# Altium schematic sheet ADC GPIO Expander.SchDoc
size A4; SheetNumber: 8; SheetTotal: 9
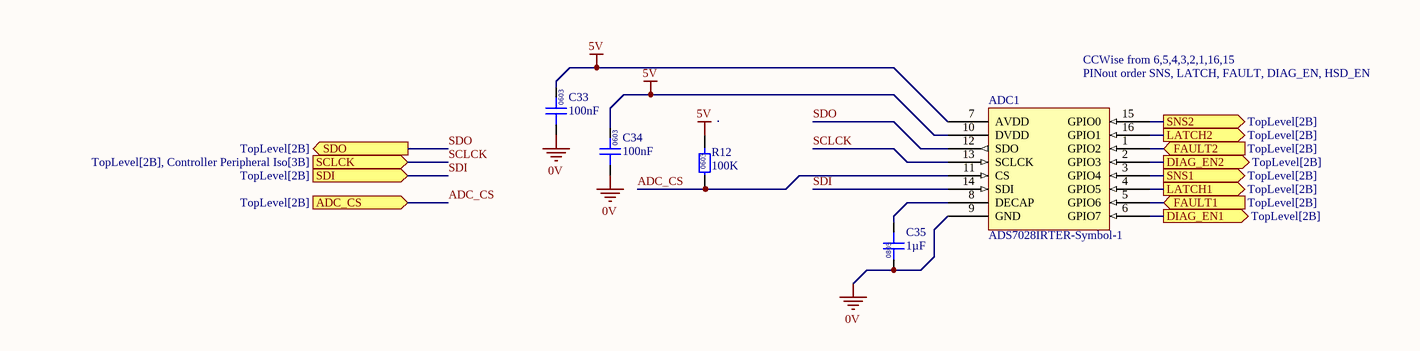
[diagram p0: ADC GPIO Expander.SchDoc]

## Parts
ADC1  ADS7028IRTER-Symbol-1  [WFQN-16]
C33  100nF  [0603]
C34  100nF  [0603]
C35  1µF  [0805]
R12  100K  [0603]

## Ports
ADC_CS (in, see TopLevel[2B]), DIAG_EN1 (out, see TopLevel[2B]), DIAG_EN2 (out, see TopLevel[2B]), FAULT1 (in, see TopLevel[2B]), FAULT2 (in, see TopLevel[2B]), LATCH1 (out, see TopLevel[2B]), LATCH2 (out, see TopLevel[2B]), SCLCK (in, see TopLevel[2B], Controller Peripheral Iso[3B]), SDI (in, see TopLevel[2B]), SDO (out, see TopLevel[2B]), SNS1 (out, see TopLevel[2B]), SNS2 (out, see TopLevel[2B])

## Nets
0V: ADC1.9(GND) C33.1 C34.1 C35.1
5V: ADC1.7(AVDD) ADC1.10(DVDD) C33.2 C34.2 R12.2
ADC_CS: ADC1.11(CS) R12.1 ; port ADC_CS
DIAG_EN1: ADC1.6(GPIO7) ; port DIAG_EN1
DIAG_EN2: ADC1.2(GPIO3) ; port DIAG_EN2
FAULT1: ADC1.5(GPIO6) ; port FAULT1
FAULT2: ADC1.1(GPIO2) ; port FAULT2
LATCH1: ADC1.4(GPIO5) ; port LATCH1
LATCH2: ADC1.16(GPIO1) ; port LATCH2
SCLCK: ADC1.13(SCLCK) ; port SCLCK
SDI: ADC1.14(SDI) ; port SDI
SDO: ADC1.12(SDO) ; port SDO
SNS1: ADC1.3(GPIO4) ; port SNS1
SNS2: ADC1.15(GPIO0) ; port SNS2
NetADC1_8: ADC1.8(DECAP) C35.2

## Notes on the sheet
- CCWise from 6,5,4,3,2,1,16,15
- (near ADC1) PINout order SNS, LATCH, FAULT, DIAG_EN, HSD_EN
- (in symbol GCM21BR71H105KA03L) 0805
- (in symbol GCM188L81H104KA57D) 0603
- (in symbol RC0603FR-07100KL) 0603

## Library data of the parts
ADC1 = ADS7028IRTER: IC ADC 12BIT SAR 16WQFN; Manufacturer: Texas Instruments; Complex IC: 1; Part Number: ADS7028IRTER; Digikey Part Number: ADS7028IRTER; Digikey Link: https://www.digikey.com.au/en/products/detail/texas-instruments/ADS7028IRTER/12696020?s=N4IgTCBcDaIIIBEDKB2ADGAHASQEoBUBRXEAXQF8g
C33 C34 = GCM188L81H104KA57D: Manufacturer: muRata; Rated Voltage: 50V; Tolerance: ±10%; Material: MLCC; Temperature Rating: X8L; Part Number: GCM188L81H104KA57D; Value: 100nF; Digikey Part Number: 490-6049-1-ND
C35 = GCM21BR71H105KA03L: Manufacturer: muRata; Rated Voltage: 50V; Tolerance: ±10%; Material: MLCC; Temperature Rating: X7R; Part Number: GCM21BR71H105KA03L; Value: 1µF; Digikey Part Number: 490-10675-1-ND
R12 = RC0603FR-07100KL: Manufacturer: YAGEO; Tolerance: 0.01; Rated Power: 0.1W; Part Number: RC0603FR-07100KL; Value: 100K; Material: FR-07